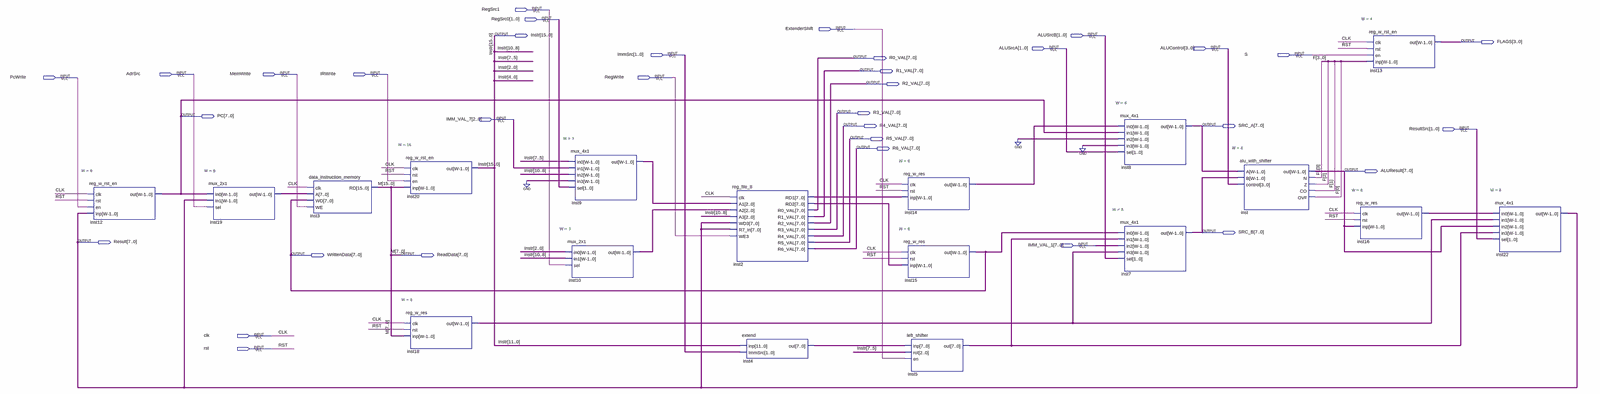
[diagram p0: schematic sheet, whole]
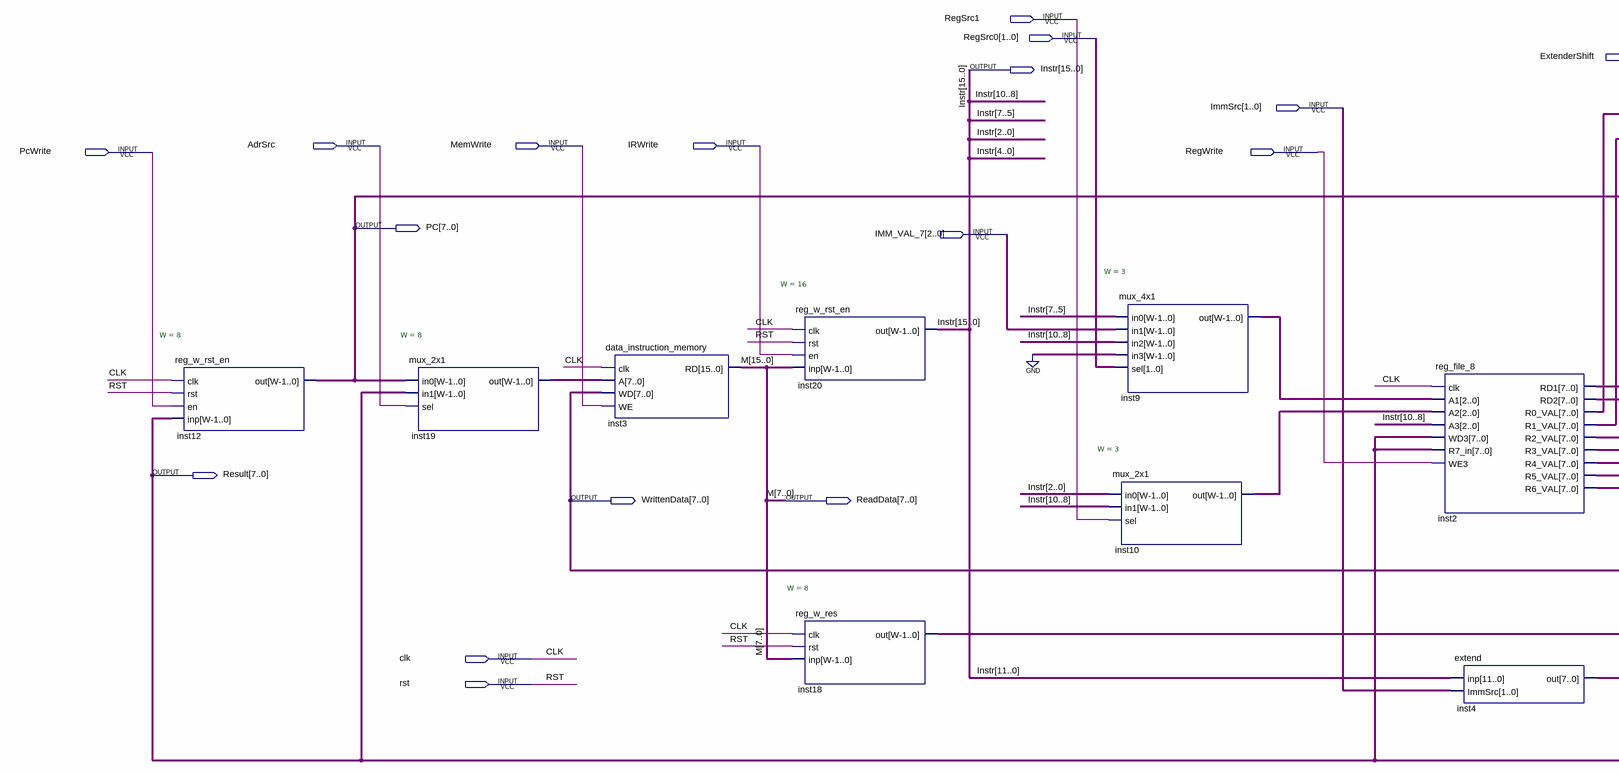
[diagram p1: schematic sheet, left part]
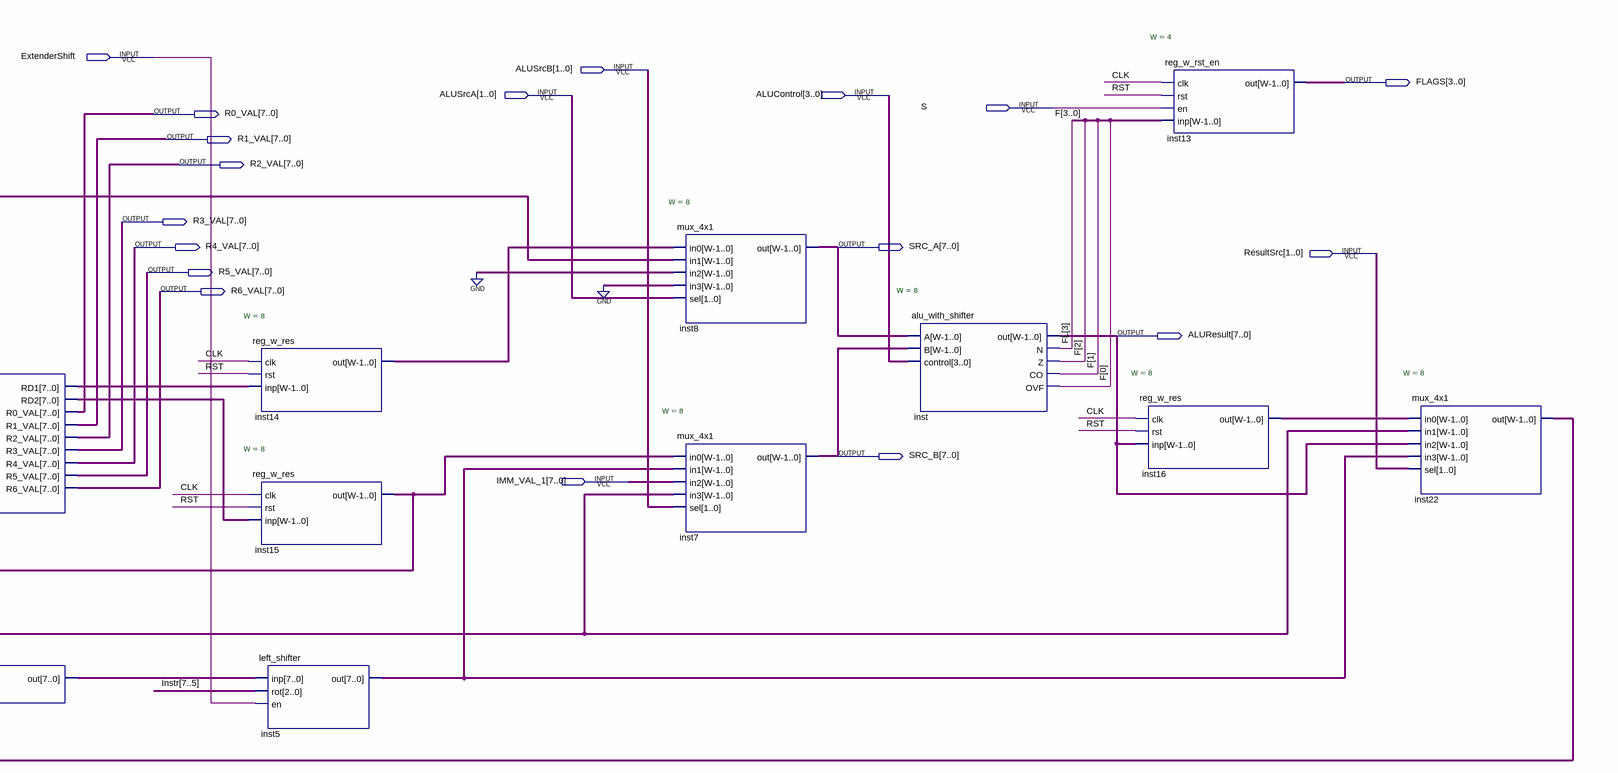
[diagram p2: schematic sheet, right part]
// Quartus schematic datapath.bdf as structural Verilog: 18 symbols, 34 pins
module datapath (
  input  RegSrc1,
  input  [1:0] RegSrc0,
  input  ExtenderShift,
  input  [1:0] ALUSrcB,
  input  [1:0] ALUSrcA,
  input  [3:0] ALUControl,
  input  [1:0] ImmSrc,
  input  S,
  input  AdrSrc,
  input  MemWrite,
  input  IRWrite,
  input  PcWrite,
  input  RegWrite,
  input  [2:0] IMM_VAL_7,
  input  [1:0] ResultSrc,
  input  [7:0] IMM_VAL_1,
  input  clk,
  input  rst,
  output [15:0] Instr,
  output [3:0] FLAGS,
  output [7:0] R0_VAL,
  output [7:0] R1_VAL,
  output [7:0] R2_VAL,
  output [7:0] R3_VAL,
  output [7:0] PC,
  output [7:0] R4_VAL,
  output [7:0] SRC_A,
  output [7:0] R5_VAL,
  output [7:0] R6_VAL,
  output [7:0] ALUResult,
  output [7:0] SRC_B,
  output [7:0] Result,
  output [7:0] WrittenData,
  output [7:0] ReadData
);

  wire [2:0] inst9_out, inst10_out;
  wire [3:0] F;
  wire [3:3] FL;
  wire [7:0] inst2_rd1, inst2_rd2, inst4_out, inst5_out, inst14_out, inst16_out, inst18_out, inst19_out;
  wire [15:8] M;

  reg_w_rst_en #(.W(8)) inst12 (.clk(clk), .rst(rst), .en(PcWrite), .inp(Result), .out(PC));
  mux_2x1 #(.W(8)) inst19 (.in0(PC), .in1(Result), .sel(AdrSrc), .out(inst19_out));
  data_instruction_memory inst3 (.clk(clk), .A(inst19_out), .WD(WrittenData), .WE(MemWrite), .RD({M, ReadData}));
  reg_w_rst_en #(.W(16)) inst20 (.clk(clk), .rst(rst), .en(IRWrite), .inp({M, ReadData}), .out(Instr));
  reg_w_res #(.W(8)) inst18 (.clk(clk), .rst(rst), .inp(ReadData), .out(inst18_out));
  mux_4x1 #(.W(3)) inst9 (
    .in0(Instr[7:5]), .in1(IMM_VAL_7), .in2(Instr[10:8]), .in3(3'b000), .sel(RegSrc0), .out(inst9_out));
  mux_2x1 #(.W(3)) inst10 (.in0(Instr[2:0]), .in1(Instr[10:8]), .sel(RegSrc1), .out(inst10_out));
  reg_file_8 inst2 (
    .clk(clk), .A1(inst9_out), .A2(inst10_out), .A3(Instr[10:8]), .WD3(Result), .R7_in(Result),
    .WE3(RegWrite), .RD1(inst2_rd1), .RD2(inst2_rd2), .R0_VAL(R0_VAL), .R1_VAL(R1_VAL), .R2_VAL(R2_VAL),
    .R3_VAL(R3_VAL), .R4_VAL(R4_VAL), .R5_VAL(R5_VAL), .R6_VAL(R6_VAL));
  extend inst4 (.inp(Instr[11:0]), .ImmSrc(ImmSrc), .out(inst4_out));
  reg_w_res #(.W(8)) inst14 (.clk(clk), .rst(rst), .inp(inst2_rd1), .out(inst14_out));
  reg_w_res #(.W(8)) inst15 (.clk(clk), .rst(rst), .inp(inst2_rd2), .out(WrittenData));
  left_shifter inst5 (.inp(inst4_out), .rot(Instr[7:5]), .en(ExtenderShift), .out(inst5_out));
  mux_4x1 #(.W(8)) inst8 (.in0(inst14_out), .in1(PC), .in2({8{1'b0}}), .in3({8{1'b0}}), .sel(ALUSrcA), .out(SRC_A));
  mux_4x1 #(.W(8)) inst7 (
    .in0(WrittenData), .in1(inst5_out), .in2(IMM_VAL_1), .in3(inst18_out), .sel(ALUSrcB), .out(SRC_B));
  alu_with_shifter #(.W(8)) inst (
    .A(SRC_A), .B(SRC_B), .control(ALUControl), .out(ALUResult), .N(FL[3]), .Z(F[2]), .CO(F[1]), .OVF(F[0]));
  reg_w_res #(.W(8)) inst16 (.clk(clk), .rst(rst), .inp(ALUResult), .out(inst16_out));
  reg_w_rst_en #(.W(4)) inst13 (.clk(clk), .rst(rst), .en(S), .inp(F), .out(FLAGS));
  mux_4x1 #(.W(8)) inst22 (
    .in0(inst16_out), .in1(inst18_out), .in2(ALUResult), .in3(inst5_out), .sel(ResultSrc), .out(Result));

  // Other names for the same wires on the sheet: M[7:0] = ReadData
endmodule
